# EAGLE schematic Leak Detector (EAGLE 8.3.2)
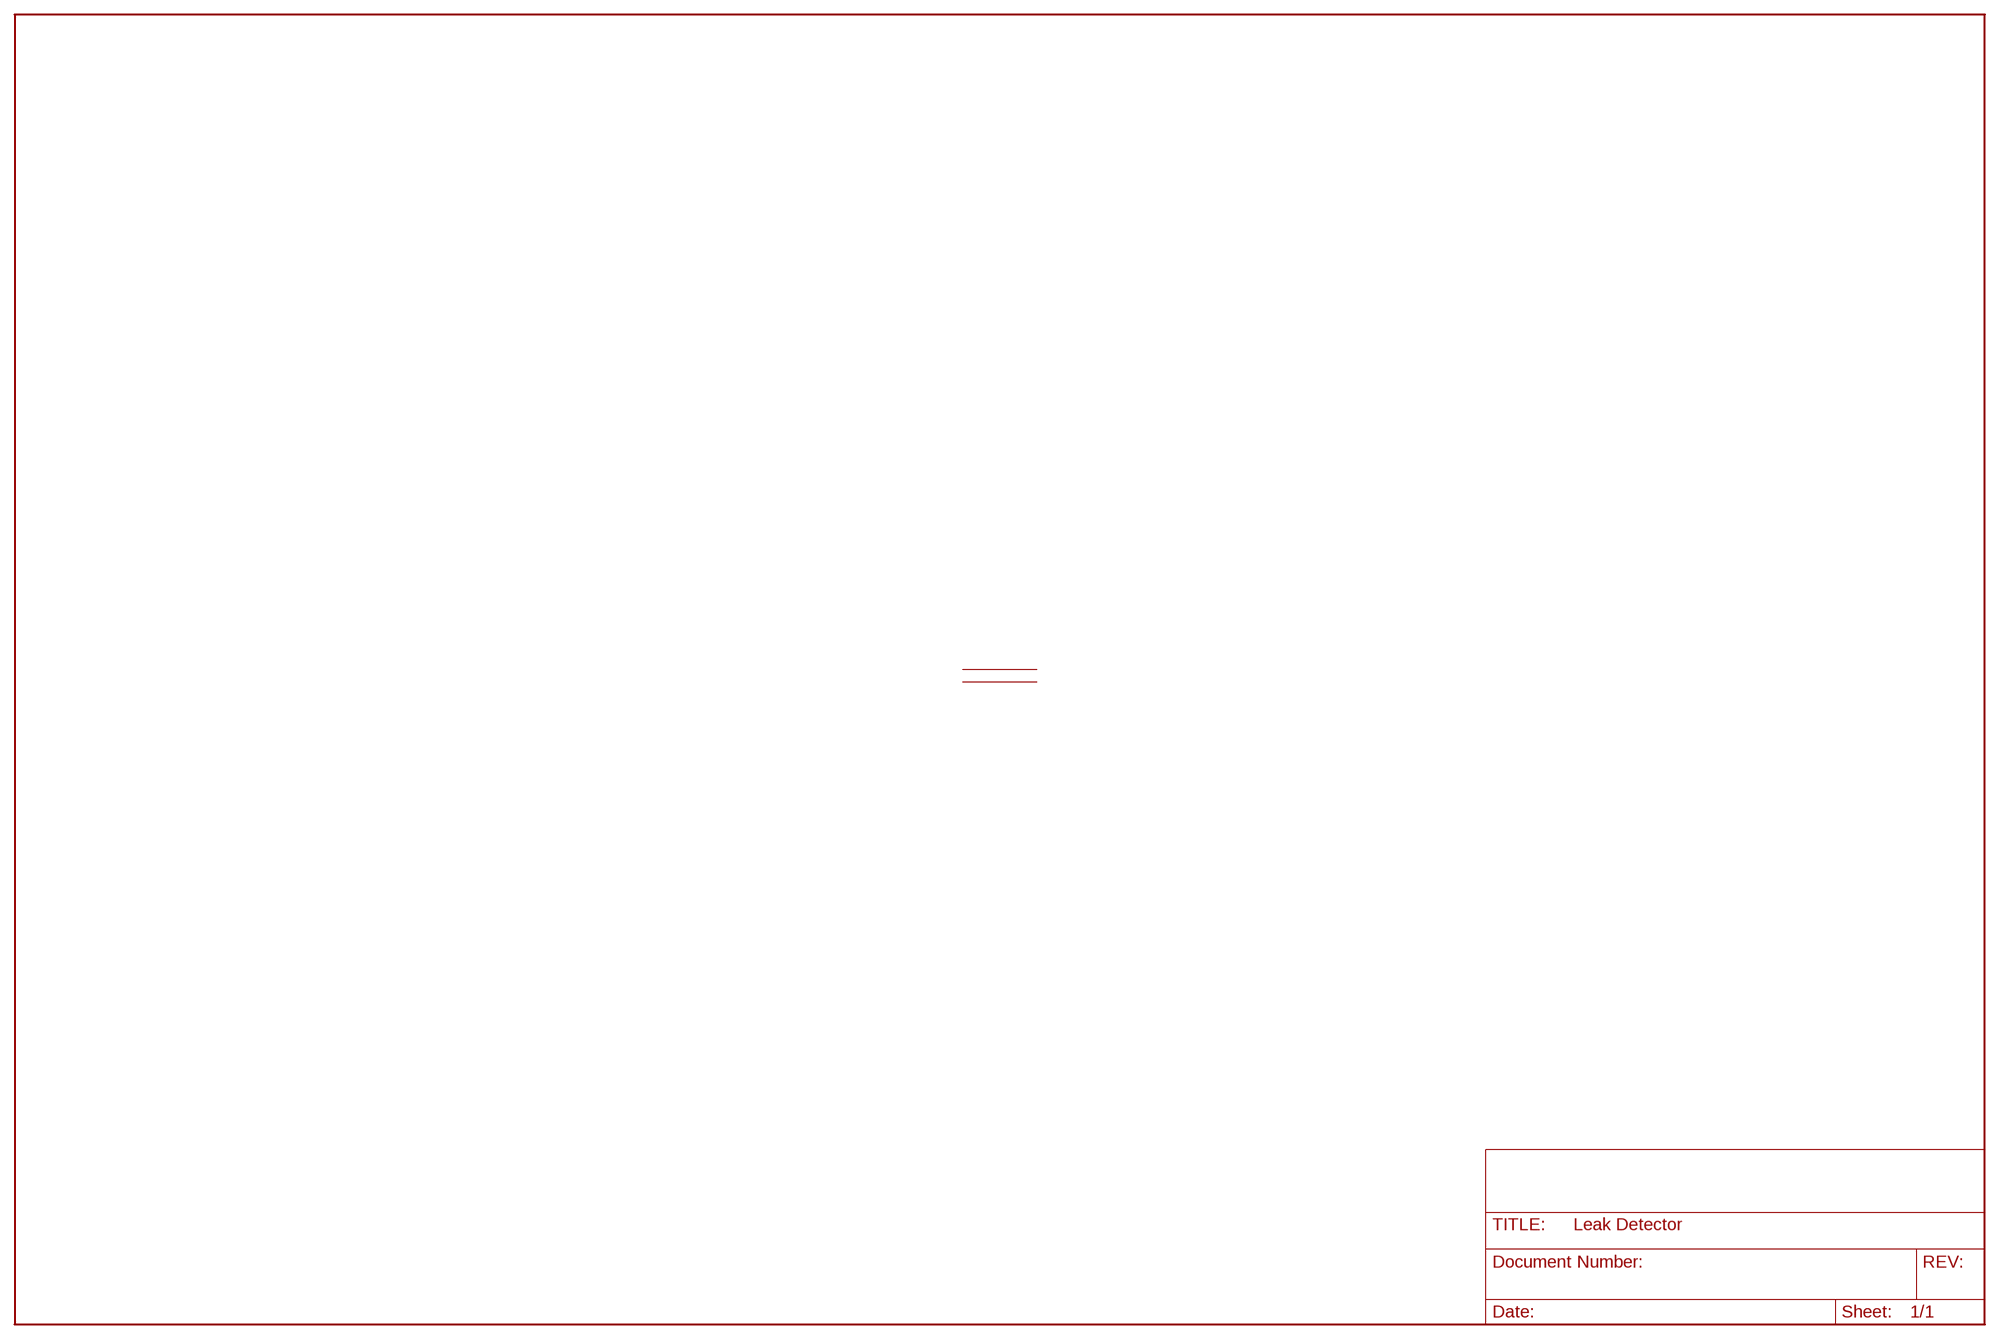
[diagram p0: schematic, sheet 1]

## Parts
U$1  COPPERWIRE  [COPPERWIRE]
U$2  COPPERWIRE  [COPPERWIRE]

## Library data of the parts
U$1 U$2 = copper-wire:COPPERWIRE